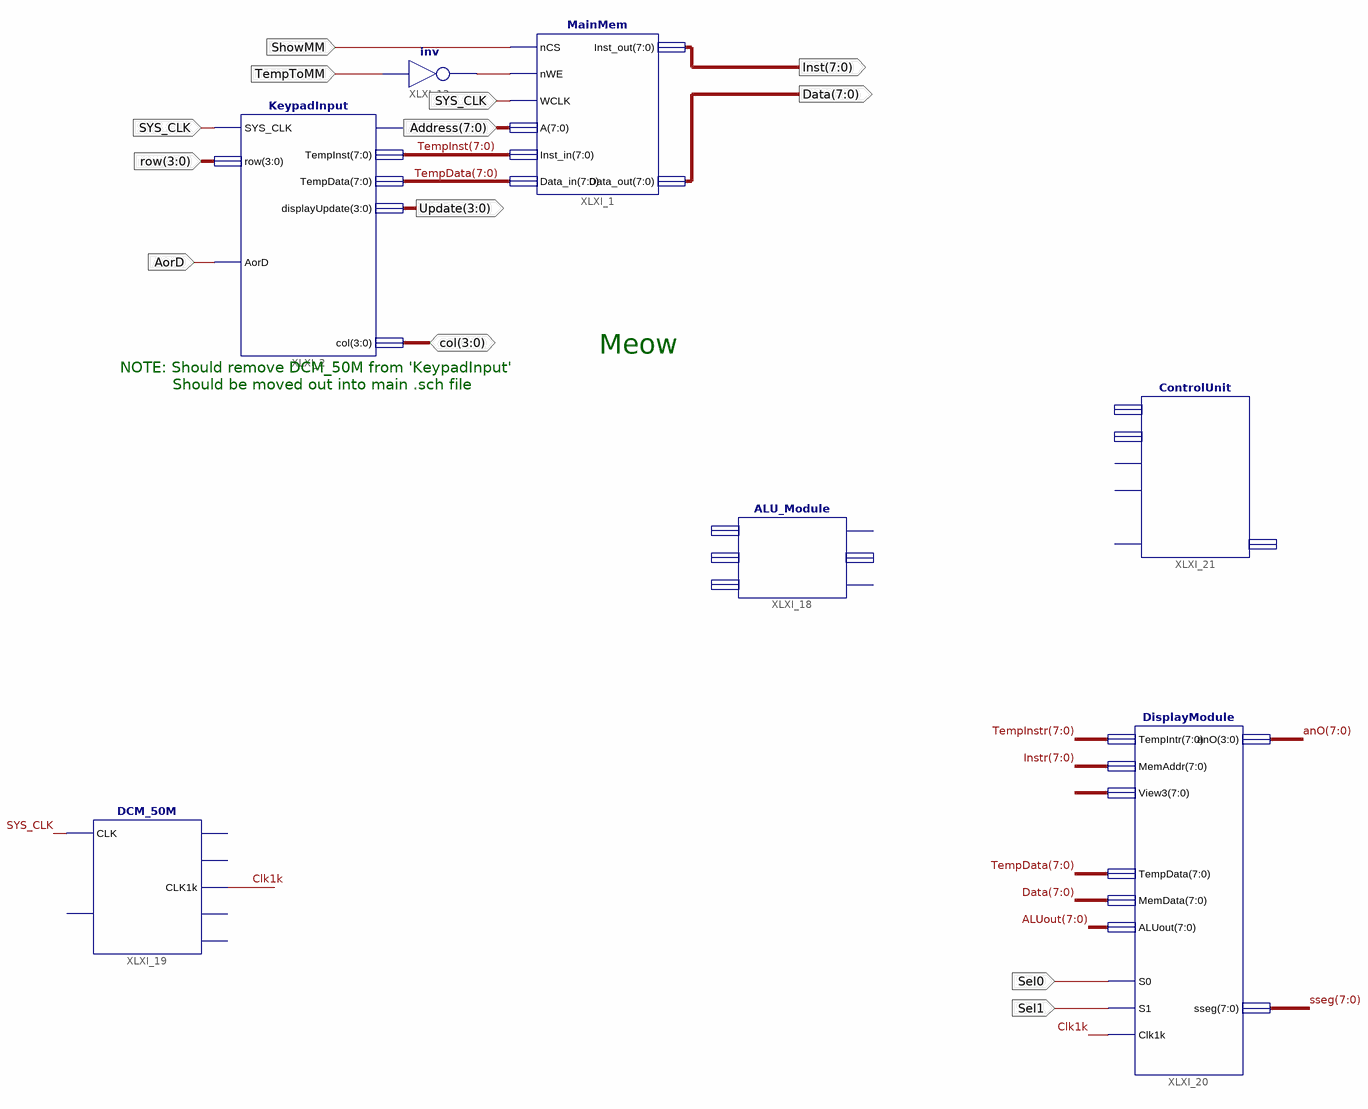
[diagram p0: schematic sheet 1]
// Xilinx ISE schematic ComputerMain.sch (spartan3e) as structural Verilog: 7 symbols, 12 ports
module ComputerMain (
  input  SYS_CLK,
  input  [7:0] Address,
  input  TempToMM,
  input  ShowMM,
  input  [3:0] row,
  input  AorD,
  input  Sel0,
  input  Sel1,
  inout  [3:0] col,
  output [7:0] Inst,
  output [7:0] Data,
  output [3:0] Update
);

  wire Clk1k, XLXN_41;
  wire [7:0] ALUout, anO, Instr, sseg, TempData, TempInst, TempInstr, XLXN_44;

  MainMem XLXI_1 (
    .nCS(ShowMM), .nWE(XLXN_41), .WCLK(SYS_CLK), .A(Address), .Inst_in(TempInst), .Data_in(TempData),
    .Inst_out(Inst), .Data_out(Data));
  not XLXI_12 (XLXN_41, TempToMM);
  ALU_Module XLXI_18 ();  // open: Ain, Bin, OP, CO, ALU_Out, OFL
  KeypadInput XLXI_2 (
    .SYS_CLK(SYS_CLK), .row(row), .AorD(AorD), .col(col), .TempInst(TempInst), .TempData(TempData),
    .displayUpdate(Update));  // open: keyValid
  DCM_50M XLXI_19 (.CLK(SYS_CLK), .CLK1k(Clk1k));  // open: RST, CLK1M, CLK10k, CLK1, CLK100
  DisplayModule XLXI_20 (
    .TempIntr(TempInstr), .MemAddr(Instr), .View3(XLXN_44), .TempData(TempData), .MemData(Data), .S0(Sel0),
    .S1(Sel1), .anO(anO), .sseg(sseg), .Clk1k(Clk1k), .ALUout(ALUout));
  ControlUnit XLXI_21 ();  // open: Inst, En_IR, En_Save, Data, CLK, Inst_out

  // Notes on the sheet:
  //   Meow
  //   NOTE: Should remove DCM_50M from 'KeypadInput'
  //   Should be moved out into main .sch file
endmodule
